# Altium schematic sheet JTAG&Trace.SchDoc: JTAG & Trace
size A4; DocumentNumber: MB1165; Revision: C.1; SheetNumber: 17; SheetTotal: 17; Project: STM32469I-EVAL
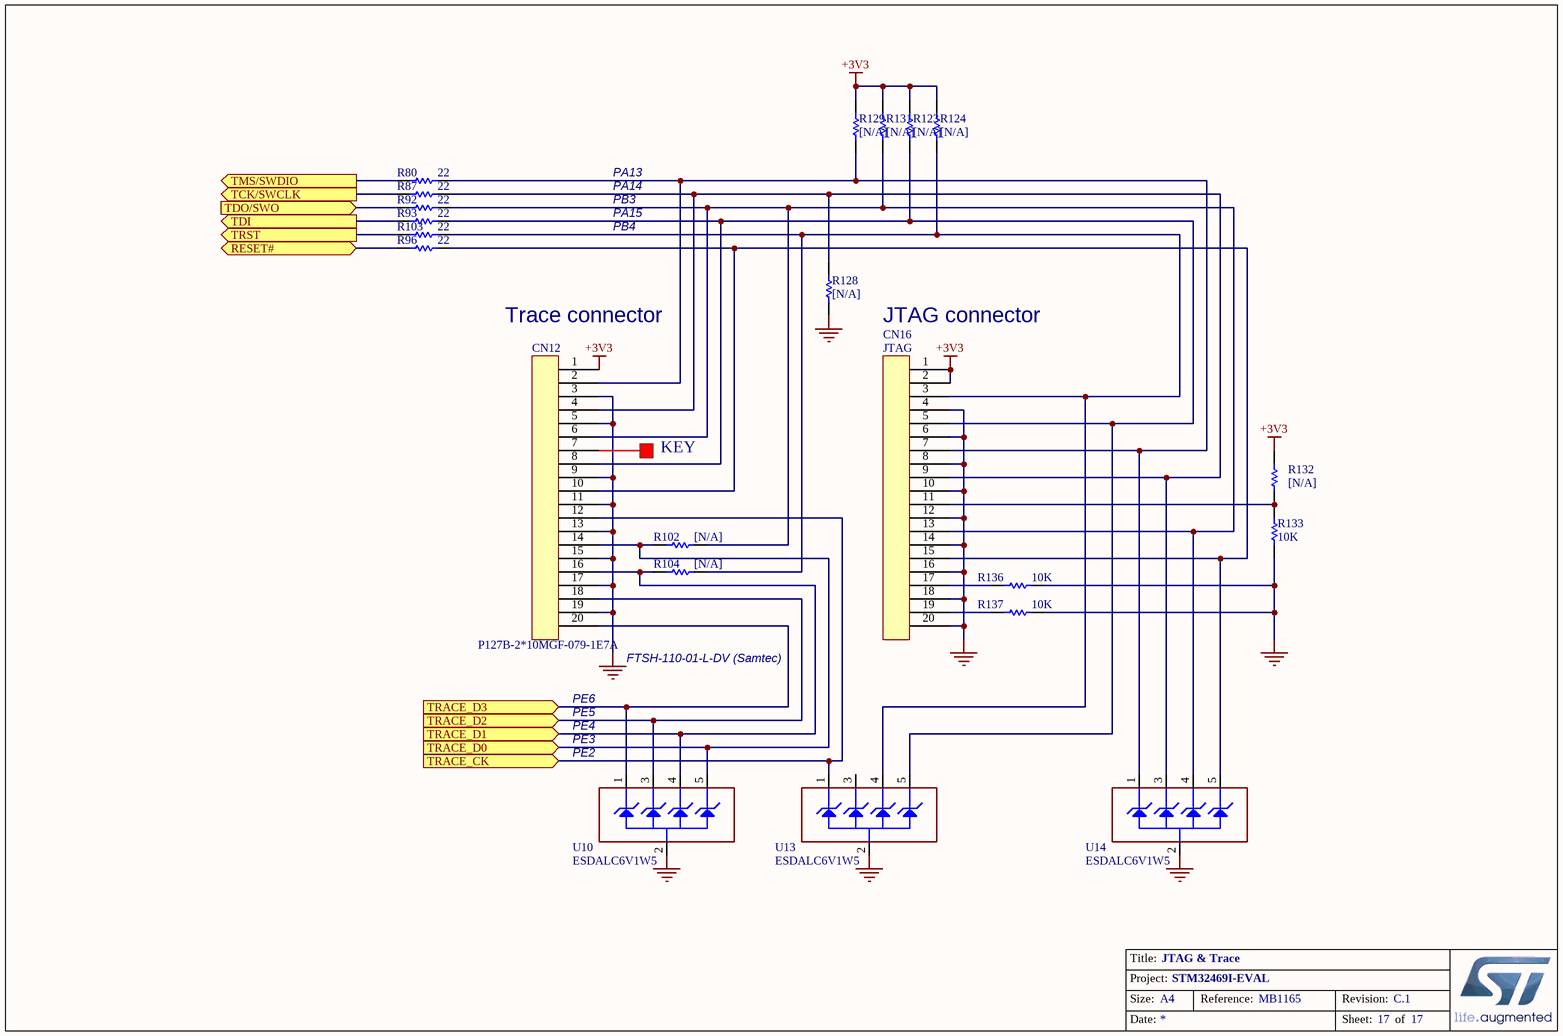
[diagram p0: JTAG&Trace.SchDoc]

## Parts
CN12  P127B-2*10MGF-079-1E7A  [FTSH-110-01-L-DV]
CN16  JTAG  [IDC20S]
R80  22  [0603R]
R87  22  [0603R]
R92  22  [0603R]
R93  22  [0603R]
R96  22  [0603R]
R102  [N/A]  [0603R]
R103  22  [0603R]
R104  [N/A]  [0603R]
R123  [N/A]  [0603R]
R124  [N/A]  [0603R]
R128  [N/A]  [0603R]
R129  [N/A]  [0603R]
R131  [N/A]  [0603R]
R132  [N/A]  [0603R]
R133  10K  [0603R]
R136  10K  [0603R]
R137  10K  [0603R]
U10  ESDALC6V1W5  [SOT-353]
U13  ESDALC6V1W5  [SOT-353]
U14  ESDALC6V1W5  [SOT-353]

## Ports
RESET# (bidir), TCK/SWCLK (out), TDI (out), TDO/SWO (in), TMS/SWDIO (out), TRACE_CK (in), TRACE_D0 (in), TRACE_D1 (in), TRACE_D2 (in), TRACE_D3 (in), TRST (out)

## Nets
+3V3: CN12.1 CN16.1 CN16.2 R123.2 R124.2 R129.2 R131.2 R132.2
GND: CN12.3 CN12.5 CN12.9 CN12.11 CN12.13 CN12.15 CN12.17 CN12.19 CN16.4 CN16.6 CN16.8 CN16.10 CN16.12 CN16.14 CN16.16 CN16.18 CN16.20 R128.1 R133.1 R136.1 R137.1 U10.2(GND) U13.2(GND) U14.2(GND)
RESET#: R96.2 ; port RESET#
TCK/SWCLK: R87.2 ; port TCK/SWCLK
TDI: R93.2 ; port TDI
TDO/SWO: R92.2 ; port TDO/SWO
TMS/SWDIO: R80.2 ; port TMS/SWDIO
TRACE_CK: CN12.12 U13.1(IO1) ; port TRACE_CK
TRACE_D0: CN12.14 R102.1 U10.5(IO4) ; port TRACE_D0
TRACE_D1: CN12.16 R104.1 U10.4(IO3) ; port TRACE_D1
TRACE_D2: CN12.18 U10.3(IO2) ; port TRACE_D2
TRACE_D3: CN12.20 U10.1(IO1) ; port TRACE_D3
TRST: R103.2 ; port TRST
NetCN12_2: CN12.2 CN16.7 R80.1 R129.1 U14.1(IO1)
NetCN12_4: CN12.4 CN16.9 R87.1 R128.2 U14.3(IO2)
NetCN12_6: CN12.6 CN16.13 R92.1 R102.2 R131.1 U14.4(IO3)
NetCN12_8: CN12.8 CN16.5 R93.1 R123.1 U13.5(IO4)
NetCN12_10: CN12.10 CN16.15 R96.1 U14.5(IO4)
NetCN16_3: CN16.3 R103.1 R104.2 R124.1 U13.4(IO3)
NetCN16_11: CN16.11 R132.1 R133.2
NetCN16_17: CN16.17 R136.2
NetCN16_19: CN16.19 R137.2

Not connected (* = marked no-connect by the designer): CN12 7; U13 3(IO2)

## Notes on the sheet
- PA13
- PA14
- PB3
- PA15
- PB4
- (near CN12) Trace connector
- JTAG connector
- KEY
- PE6
- PE5
- (near CN12) FTSH-110-01-L-DV (Samtec)
- PE4
- PE3
- (near U10) PE2
- Title:
- Project:
- Size:
- Date:
- A4
- Reference:
- Sheet:
- Revision:
- of

## Library data of the parts
CN12 CN16 = 20PIN1
R80 R87 R92 R93 R96 R102-R104 R123 R124 R128 R129 R131-R133 R136 R137 = Res1: Resistor; Value: 1K; Published: 8-Jun-2000; Revision: July-2002: Re-released for DXP Platform.; Publisher: Altium Limited
U10 U13 U14 = ESDALC6V1W5: Dual Transil array for ESD protection; Manuf_1: STM; Manuf_Part_1: ESDA5V3L; Ref St: 9179034; Provided: ST; ECCN_US/EU: EAR99/NEC; Distrib: ST; Order: ESDA5V3L; Ordered by: STM